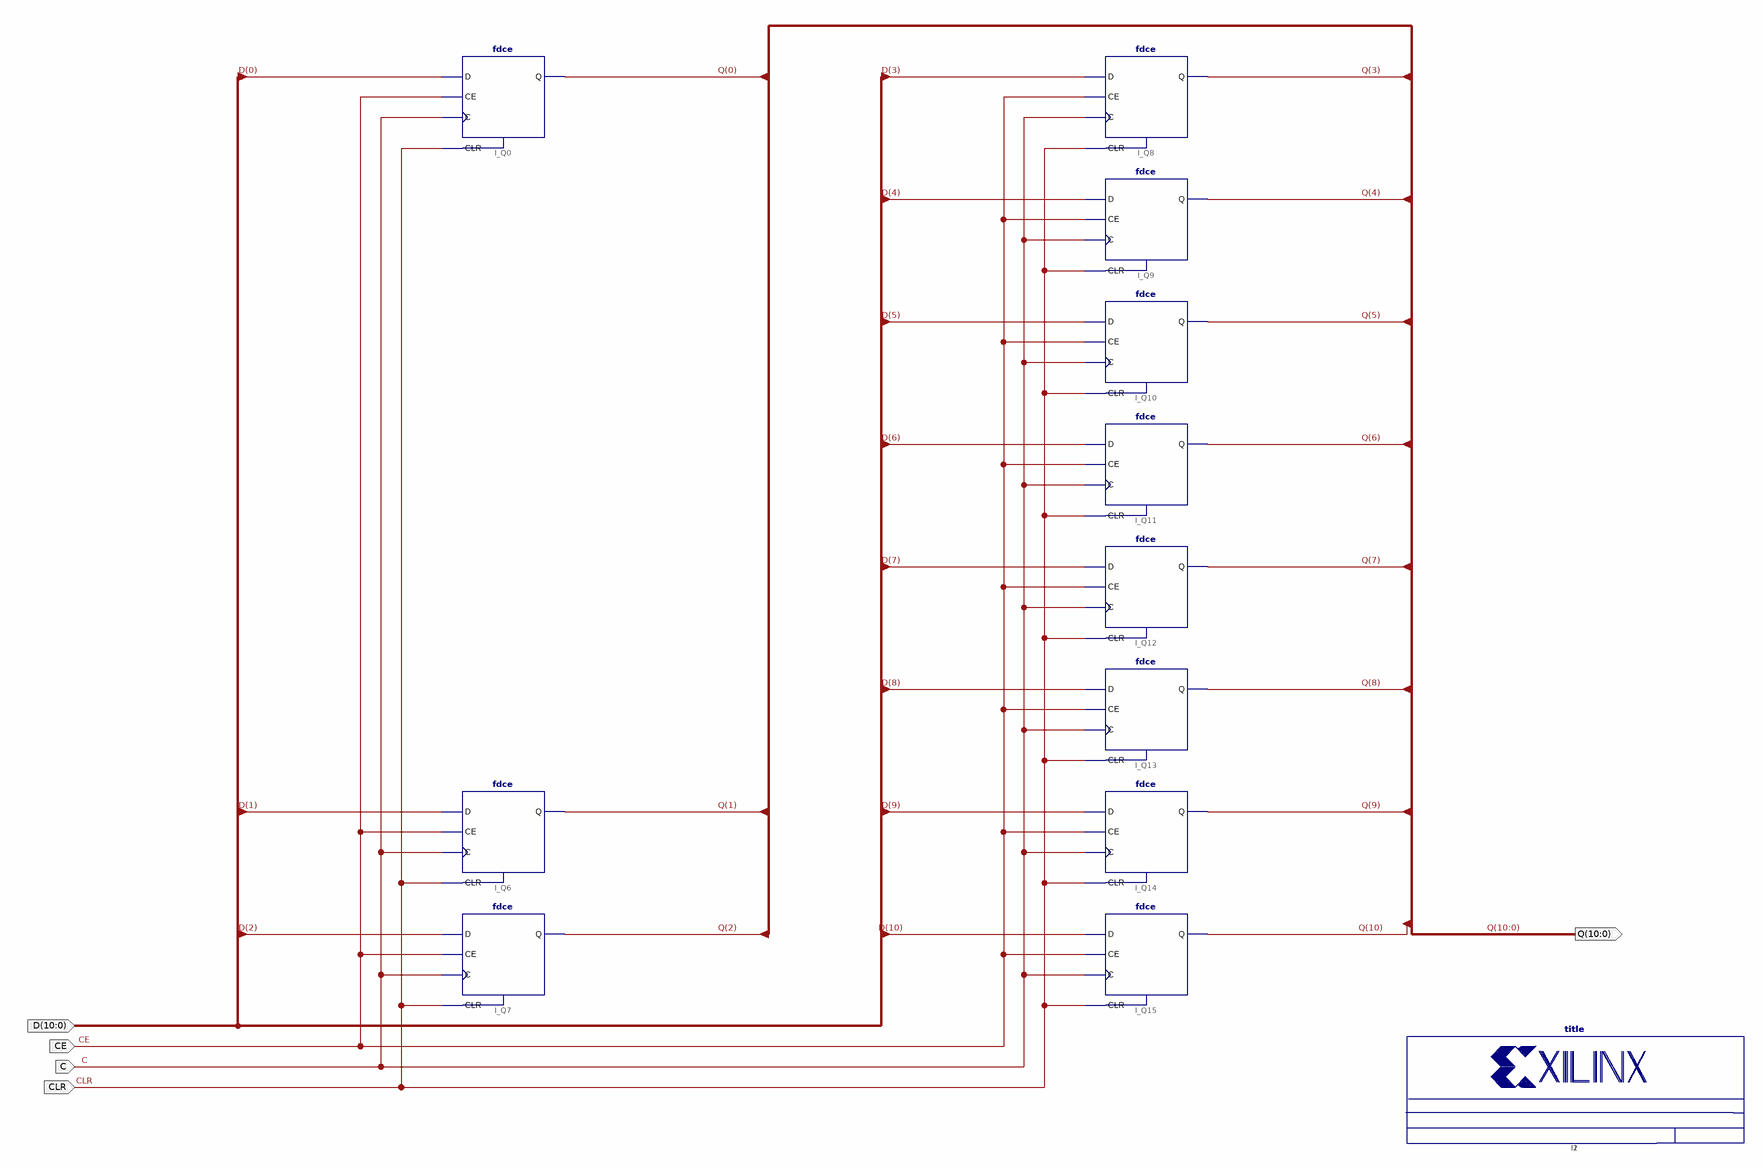
[diagram p0: schematic sheet 1]
// Xilinx ISE schematic fd11ce.sch (spartan3e) as structural Verilog: 13 symbols, 5 ports
module fd11ce (
  input  CLR,
  input  C,
  input  CE,
  input  [10:0] D,
  output [10:0] Q
);

  fdce I_Q0 (.C(C), .CE(CE), .CLR(CLR), .D(D[0]), .Q(Q[0]));
  fdce I_Q6 (.C(C), .CE(CE), .CLR(CLR), .D(D[1]), .Q(Q[1]));
  fdce I_Q7 (.C(C), .CE(CE), .CLR(CLR), .D(D[2]), .Q(Q[2]));
  fdce I_Q8 (.C(C), .CE(CE), .CLR(CLR), .D(D[3]), .Q(Q[3]));
  fdce I_Q9 (.C(C), .CE(CE), .CLR(CLR), .D(D[4]), .Q(Q[4]));
  fdce I_Q10 (.C(C), .CE(CE), .CLR(CLR), .D(D[5]), .Q(Q[5]));
  fdce I_Q11 (.C(C), .CE(CE), .CLR(CLR), .D(D[6]), .Q(Q[6]));
  fdce I_Q12 (.C(C), .CE(CE), .CLR(CLR), .D(D[7]), .Q(Q[7]));
  fdce I_Q13 (.C(C), .CE(CE), .CLR(CLR), .D(D[8]), .Q(Q[8]));
  fdce I_Q14 (.C(C), .CE(CE), .CLR(CLR), .D(D[9]), .Q(Q[9]));
  fdce I_Q15 (.C(C), .CE(CE), .CLR(CLR), .D(D[10]), .Q(Q[10]));
  title I1 ();
  title I2 ();
endmodule
